# EAGLE design ATtiny_45_85_development_board (EAGLE 6.0)
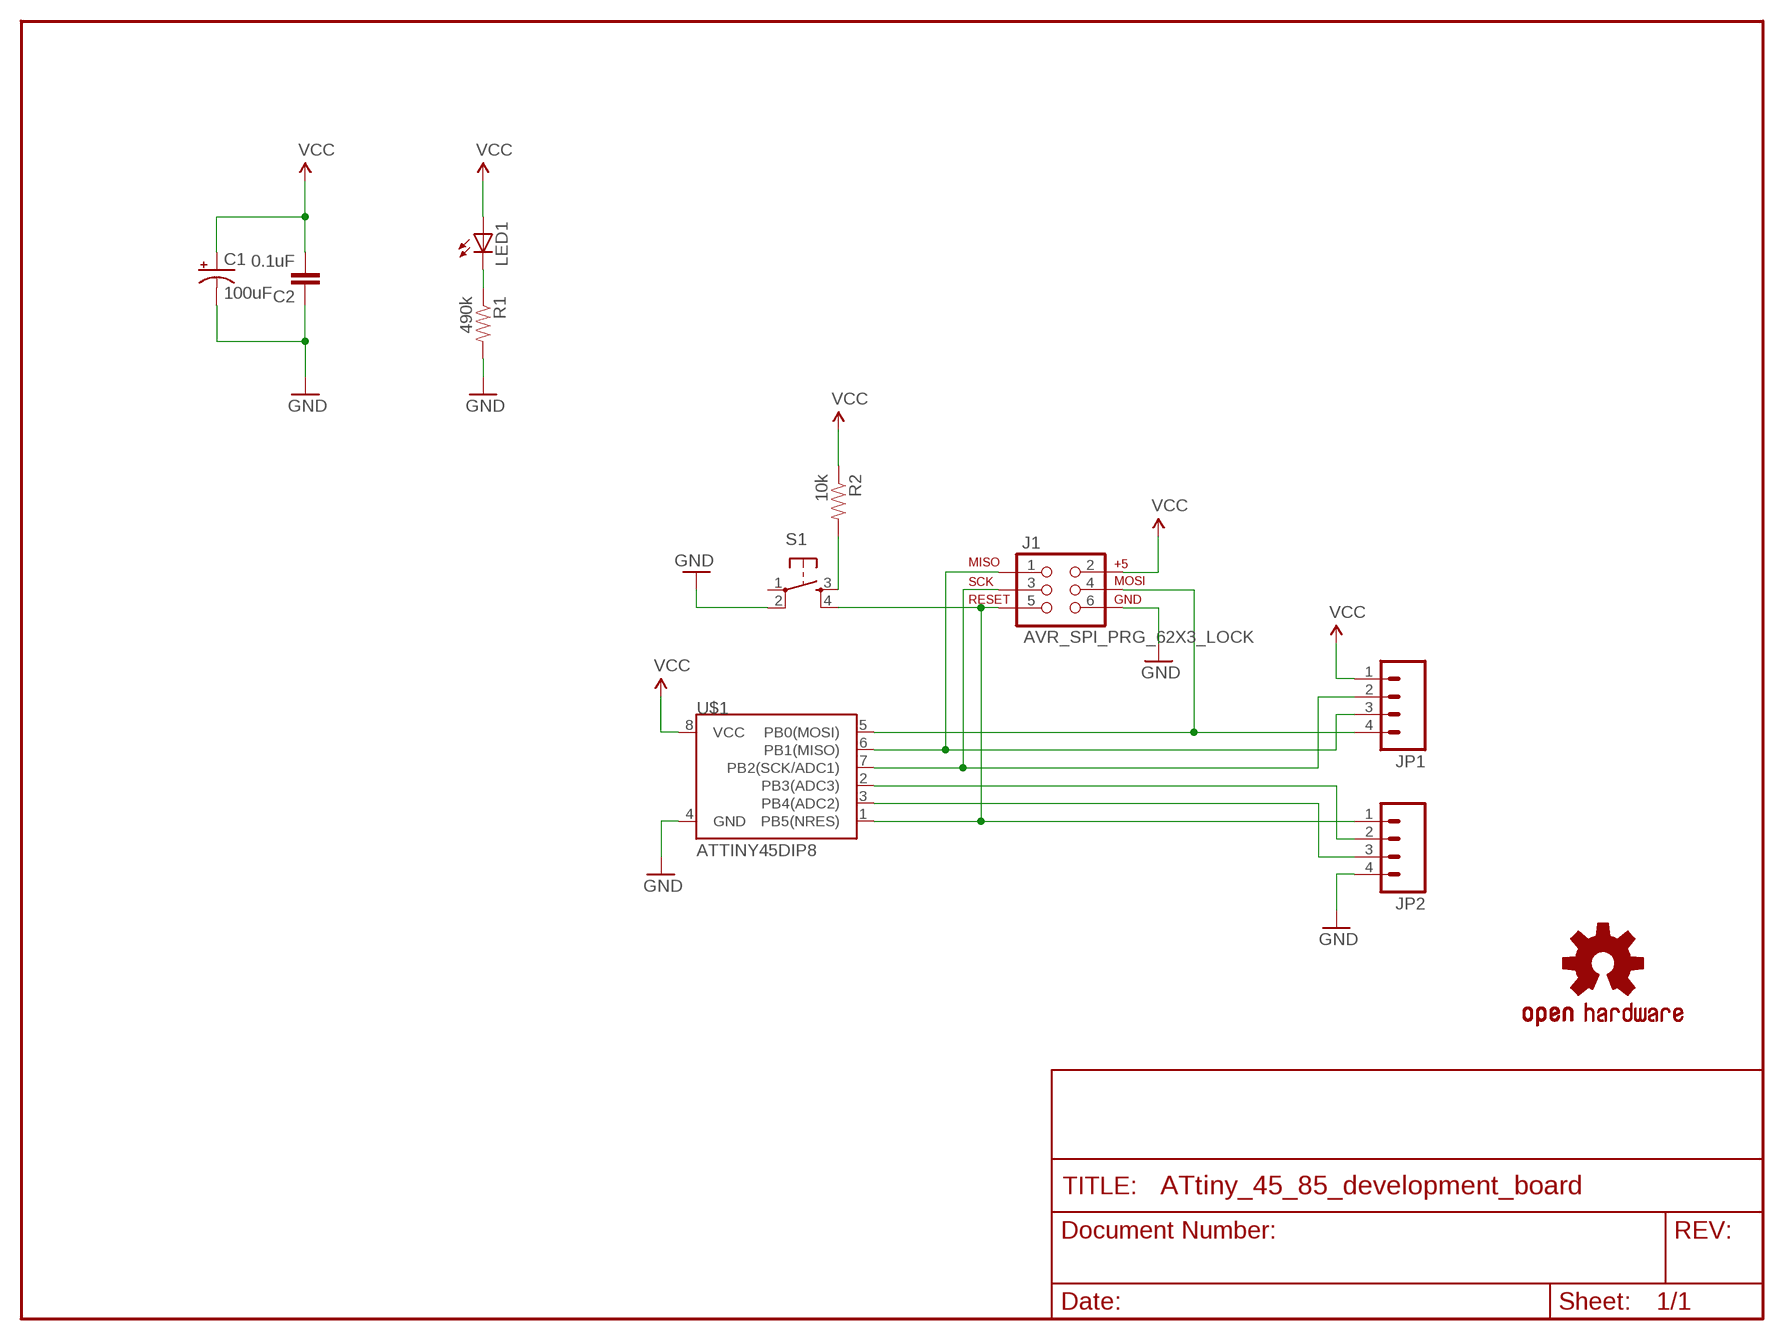
[diagram p0: schematic, sheet 1]

## Parts
C1  100uF  CAP_POLPTH1  [CPOL-RADIAL-100UF-25V]
C2  0.1uF  CAPPTH1  [CAP-PTH-5MM]
J1  AVR_SPI_PRG_62X3_LOCK  [2X3_LOCK]
JP1  M04LOCK  [1X04_LOCK]
JP2  M04LOCK  [1X04_LOCK]
LED1  LED5MM  [LED5MM]
R1  490k  RESISTORPTH-1/4W  [AXIAL-0.4]
R2  10k  RESISTORPTH-1/4W  [AXIAL-0.4]
S1  TAC_SWITCHPTH  [TACTILE-PTH]
U$1  ATTINY45DIP8  [DIP08]
U$2  OSHW-LOGOS  [OSHW-LOGO-S]

## Nets
GND: C1.2(-) C2.1 J1.6 JP2.4 R1.P$2 S1.2 U$1.4(GND)
N$1: LED1.K(C) R1.P$1
N$2: J1.4 JP1.4 U$1.5(PB0(MOSI))
N$3: J1.5 JP2.1 S1.4 U$1.1(PB5(NRES))
N$6: J1.1 JP1.3 U$1.6(PB1(MISO))
N$7: J1.3 JP1.2 U$1.7(PB2(SCK/ADC1))
N$8: R2.P$2 S1.3
N$9: JP2.2 U$1.2(PB3(ADC3))
N$10: JP2.3 U$1.3(PB4(ADC2))
VCC: C1.1(+) C2.2 J1.2 JP1.1 LED1.A R2.P$1 U$1.8(VCC)
Unconnected: S1.1

## Library data of the parts
C1 = SparkFun:CAP_POL: Capacitor Polarized These are standard SMD and PTH capacitors. Normally 10uF, 47uF, and 100uF in electrolytic and tantalum varieties. Always verify the external diameter of the through hole cap, it varies with capacity, voltage, and manufacturer. The EIA devices should be standard.
C2 = SparkFun:CAP: Capacitor Standard 0603 ceramic capacitor, and 0.1" leaded capacitor.
J1 = SparkFun:AVR_SPI_PRG_6: AVR ISP 6 Pin This is the reduced ISP connector for AVR programming. Common on Arduino. This footprint will take up less PCB space and can be used with a 10-pin to 6-pin adapter such as SKU: BOB-08508
JP1 JP2 = SparkFun:M04: Header 4 Standard 4-pin 0.1" header. Use with straight break away headers (SKU : PRT-00116), right angle break away headers (PRT-00553), swiss pins (PRT-00743), machine pins (PRT-00117), and female headers (PRT-00115). Molex polarized connector foot print use with SKU : PRT-08231 with associated crimp pins and housings. 1MM SMD Version SKU: PRT-10208
LED1 = SparkFun:LED: LEDs Standard schematic elements and footprints for 5mm, 3mm, 1206, and 0603 sized LEDs. 5mm - Spark Fun Electronics SKU : COM-00529 (and others)
R1 R2 = SparkFun:RESISTOR: Resistor Basic schematic elements and footprints for 0603, 1206, and PTH resistors.
S1 = SparkFun:TAC_SWITCH: Momentary Switch Button commonly used for reset or general input. Spark Fun Electronics SKU : COM-00097
U$1 = SparkFun:ATTINY45: Atmel ATTiny45
U$2 = SparkFun:OSHW-LOGO: Open Source Hardware Logo This logo indicates the piece of hardware it is found on incorporates a OSHW license and/or adheres to the definition of open source hardware found here: http://freedomdefined.org/OSHW

## Board
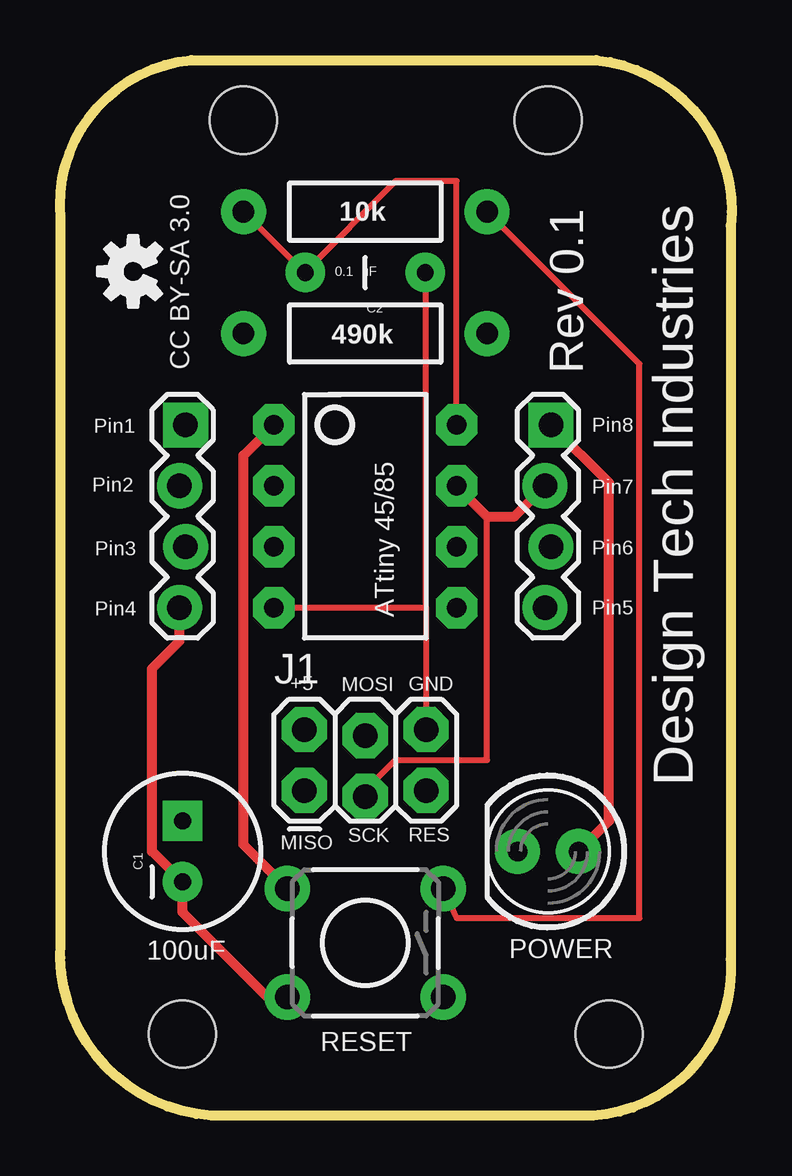
[diagram p1: board, top side]
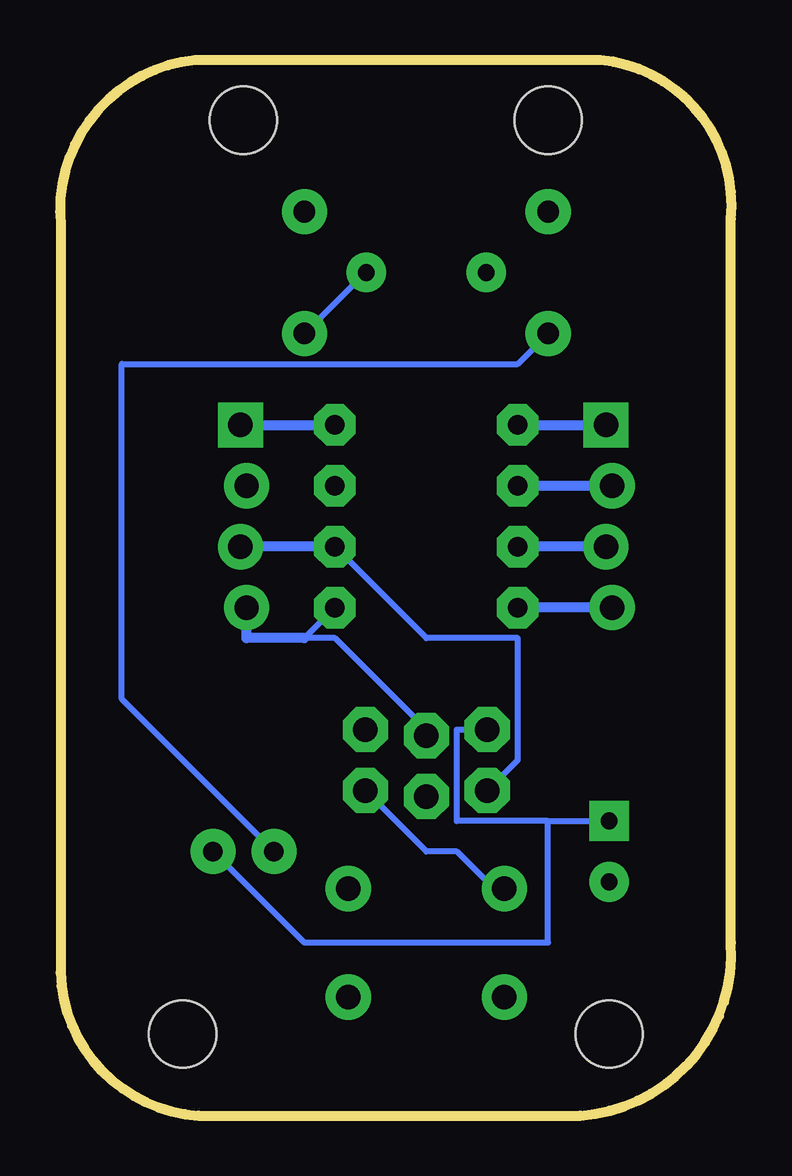
[diagram p2: board, bottom side, seen from below]

Size 28 x 44 mm. Coordinates in mm from the lower left corner, seen from the top.
Outline: 0.03,37.37 arc-90 5.48,44 22.35,44 arc-90 27.97,37.08 27.97,6.53 arc-90 22.22,0 6.31,0 arc-90 0.03,7.2 0.03,37.37
Copper layers (1*16): Top 0.035mm / dielectric 1.5mm / Bottom 0.035mm
Design rules: minimum track width 8mil, minimum drill 20mil, track to track 8mil, track to pad 8mil, pad to pad 8mil, via to via 8mil, smd to smd 8mil, copper to edge 10mil, drill to drill 8mil, minimum pad ring 12mil, minimum via ring 10mil, stop-mask expansion 4mil, vias tented up to drill 25mil, thermal gap 10mil
Holes 2.8 mm at 5.11,3.39 22.89,3.39 7.65,41.49 20.35,41.49

### Footprints (pad centres in the part's own frame; a part is rotated, then mirrored left to right if it is on the bottom)
CPOL-RADIAL-100UF-25V = drill 0.7 pad 1.651 square: 1 1.27,0 | drill 0.7 pad 1.651: 2 -1.27,0
CAP-PTH-5MM = drill 0.7 pad 1.651: 1 -2.5,0; 2 2.5,0
2X3_LOCK = drill 1.016 pad 1.88 octagon: 1 0,0; 2 0,2.54; 3 2.54,-0.254; 4 2.54,2.286; 5 5.08,0; 6 5.08,2.54
1X04_LOCK = drill 1.016 pad 1.88 square: 1 0,0.127 | drill 1.016 pad 1.88: 2 2.54,-0.127; 3 5.08,0.127; 4 7.62,-0.127
LED5MM = drill 0.813 pad 1.88: A -1.27,0; K 1.27,0
AXIAL-0.4 = drill 0.9 pad 1.88: P$1 -5.08,0; P$2 5.08,0
TACTILE-PTH = drill 1.016 pad 1.88: 1 -3.251,2.261; 2 3.251,2.261; 3 -3.251,-2.261; 4 3.251,-2.261
DIP08 = drill 0.813 pad 1.727 octagon: 1 -3.81,-3.81; 2 -1.27,-3.81; 3 1.27,-3.81; 4 3.81,-3.81; 5 3.81,3.81; 6 1.27,3.81; 7 -1.27,3.81; 8 -3.81,3.81

### Placement (x,y rotation side)
C1  5.11,11.01 90 top
C2  12.73,35.14 180 top
J1  10.19,13.55 0 top
JP1  20.35,28.79 270 top
JP2  5.11,28.79 270 top
LED1  20.35,11.01 180 top
R1  12.73,32.6 0 top
R2  12.73,37.68 0 top
S1  12.73,7.2 180 top
U$1  12.73,24.98 270 top
U$2  3.05,35.18 90 top

### Tracks (layer width: path | path; a pad name or v marks a point on that pad's centre or on a via)
GND
  Top 0.254: 15.27,21.17 15.27,35.14 C2.1 | 15.27,21.17 J1.6 | U$1.4 15.27,21.17
  Top 0.406: JP2.4 4.98,19.77 3.84,18.63 3.84,11.01 C1.2 5.11,8.47 8.64,4.94 S1.2
  Bottom 0.254: R1.P$2 15.27,35.14 C2.1
  Bottom 0.406: JP2.4 U$1.4
N$1
  Bottom 0.254: LED1.K 25.43,17.36 25.43,31.33 8.92,31.33 R1.P$1
N$2
  Bottom 0.254: U$1.5 17.81,19.9 16.54,19.9 12.73,16.09 J1.4
  Bottom 0.406: 17.81,19.9 20.22,19.9 JP1.4
N$3
  Top 0.406: U$1.1 7.65,27.52 7.65,11.29 S1.4
  Bottom 0.254: J1.5 12.73,11.01 11.46,11.01 10.19,9.74 S1.4
  Bottom 0.406: U$1.1 JP2.1
N$6
  Bottom 0.254: J1.1 8.92,14.82 8.92,19.9 12.73,19.9 U$1.6
  Bottom 0.406: U$1.6 JP1.3
N$7
  Top 0.254: 17.81,24.98 17.81,14.82 14,14.82 12.73,13.55 J1.3
  Top 0.406: JP1.2 18.95,24.98 17.81,24.98 U$1.7
N$8
  Top 0.254: R2.P$2 24.16,31.33 24.16,8.23 16.54,8.23 S1.3
N$9
  Bottom 0.406: JP2.2 U$1.2
N$10
  Bottom 0.406: JP2.3 U$1.3
VCC
  Top 0.254: 10.19,35.14 R2.P$1 | 10.19,35.14 14,38.95 16.54,38.95 U$1.8 | 10.19,35.14 C2.2
  Top 0.406: JP1.1 22.89,26.38 22.89,12.28 LED1.A
  Bottom 0.254: 7.65,12.28 11.46,12.28 11.46,16.09 J1.2 | 7.65,12.28 C1.1 | 7.65,12.28 7.65,7.2 17.81,7.2 LED1.A
  Bottom 0.406: JP1.1 U$1.8

### Text on the board
tPlace: Design Tech Industries | 0.1 uF | CC BY-SA 3.0 | Rev 0.1 | Pin1 | Pin8 | Pin2 | Pin7 | Pin3 | Pin6 | Pin4 | Pin5 | ATtiny 45/85 | +5 | MOSI | GND | MISO | SCK | RES | 100uF | POWER | RESET